# EAGLE design DB3000 (EAGLE 8.4.3)
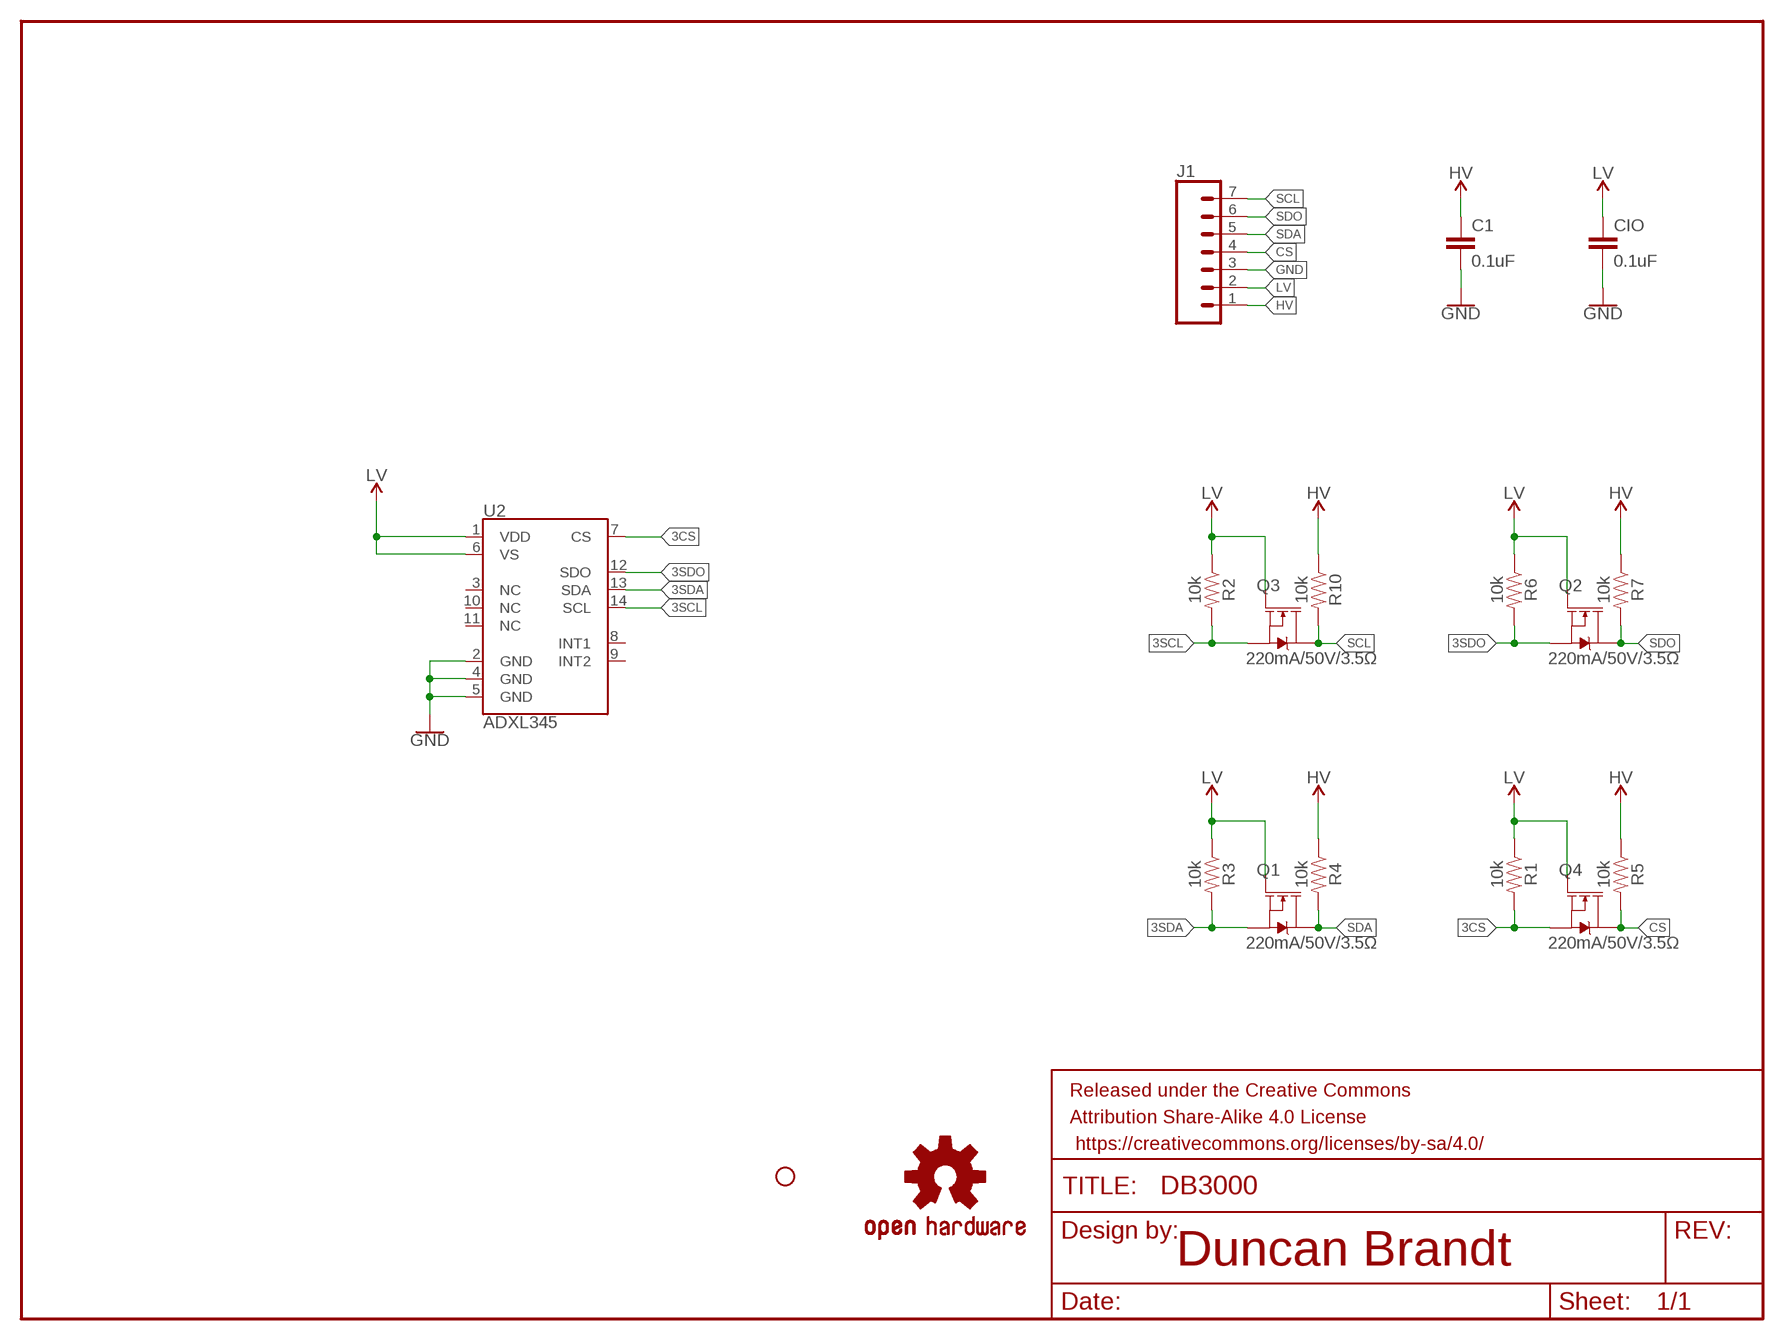
[diagram p0: schematic, sheet 1]

## Parts
C1  0.1uF  0.1UF-0603-25V-5%  [0603]
CIO  0.1uF  0.1UF-0603-25V-5%  [0603]
FRAME1  FRAME-LETTER  [CREATIVE_COMMONS]
J1  CONN_07  [1X07]
JP3  STAND-OFF  [STAND-OFF]
LOGO1  OSHW-LOGOL  [OSHW-LOGO-L]
Q1  220mA/50V/3.5Ω  MOSFET-NCH-M-BSS138  [SOT23-3]
Q2  220mA/50V/3.5Ω  MOSFET-NCH-M-BSS138  [SOT23-3]
Q3  220mA/50V/3.5Ω  MOSFET-NCH-M-BSS138  [SOT23-3]
Q4  220mA/50V/3.5Ω  MOSFET-NCH-M-BSS138  [SOT23-3]
R1  10k  10KOHM-0603-1/10W-1%  [0603]
R2  10k  10KOHM-0603-1/10W-1%  [0603]
R3  10k  10KOHM-0603-1/10W-1%  [0603]
R4  10k  10KOHM-0603-1/10W-1%  [0603]
R5  10k  10KOHM-0603-1/10W-1%  [0603]
R6  10k  10KOHM-0603-1/10W-1%  [0603]
R7  10k  10KOHM-0603-1/10W-1%  [0603]
R10  10k  10KOHM-0603-1/10W-1%  [0603]
U2  ADXL345  [LGA-14]

## Nets
3CS: Q4.2(S) R1.2 U2.7(CS)
3SCL: Q3.2(S) R2.2 U2.14(SCL)
3SDA: Q1.2(S) R3.2 U2.13(SDA)
3SDO: Q2.2(S) R6.2 U2.12(SDO)
CS: J1.4 Q4.3(D) R5.2
GND: C1.2 CIO.2 J1.3 U2.2(GND) U2.4(GND) U2.5(GND)
HV: C1.1 J1.1 R4.1 R5.1 R7.1 R10.1
LV: CIO.1 J1.2 Q1.1(G) Q2.1(G) Q3.1(G) Q4.1(G) R1.1 R2.1 R3.1 R6.1 U2.1(VDD) U2.6(VS)
SCL: J1.7 Q3.3(D) R10.2
SDA: J1.5 Q1.3(D) R4.2
SDO: J1.6 Q2.3(D) R7.2
Unconnected: U2.3(NC) U2.8(INT1) U2.9(INT2) U2.10(NC) U2.11(NC)

## Notes on the sheet
- Duncan Brandt

## Library data of the parts
C1 CIO = DB-CAP:0.1UF: 0.1µF ceramic capacitors Package: 0603 A capacitor is a passive two-terminal electrical component used to store electrical energy temporarily in an electric field. DB BOARDS: DB Drawing Board <www.dbboards.com>; PROD_ID: CAP-08604
FRAME1 = DB-SYMBOLS:FRAME-LETTER: Schematic Frame - Letter Standard 8.5x11 US Letter frame
J1 = DB-CONN:CONN_07: 7 Pin Header Multi connection point. Often used as Generic Header-pin footprint for 0.1 inch spaced/style header connections DB BOARDS: DB Drawing Board <www.dbboards.com>
JP3 = DB-HARDWARE:STAND-OFF: #4 Phillips Hole Screw Hole Mount Hole DB BOARDS: DB Drawing Board <www.dbboards.com>
LOGO1 = DB-SYMBOLS:OSHW-LOGO: Open-Source Hardware (OSHW) Logo This logo indicates the piece of hardware it is found on incorporates a OSHW license and/or adheres to the definition of open source hardware found here: http://freedomdefined.org/OSHW
Q1-Q4 = DB-DESCSEMI:MOSFET-NCH-M: N-channel MOSFETs Voltage controlled devices that allow control of high current outputs.; PROD_ID: DBP2101
R1-R7 R10 = DB-RES:10KOHM: 10kΩ Resistor Package: 0603 A resistor is a passive two-terminal electrical component that implements electrical resistance as a circuit element. Resistors act to reduce current flow, and, at the same time, act to lower voltage levels within circuits. - Wikipedia DB BOARDS: DB Drawing Board <www.dbboards.com>; PROD_ID: RES-00824
U2 = DB-IC:ADXL345: Analog Devices ADXL345 3-Axis SPI/I2C 2/4/8/16g Accelerometer The ADXL345 is a small, thin, low power, 3-axis accelerometer with high resolution (13-bit) measurement at up to ±16g. Digital output data is formatted as 16-bit twos complement and is accessible through either a SPI (3- or 4-wire) or I2C digital interface.; PROD_ID: DBP1002; SF_ID: DB3000

## Board
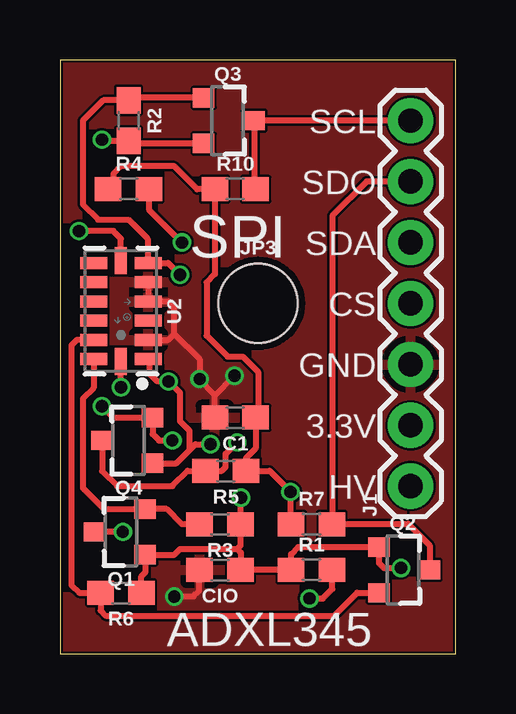
[diagram p1: board, top side]
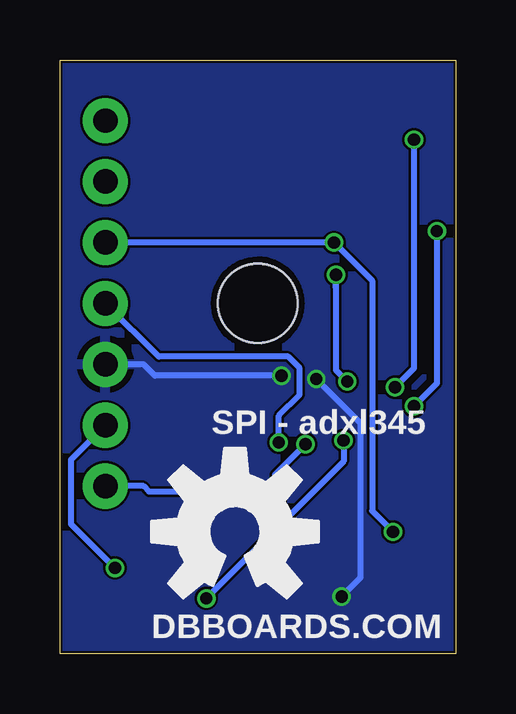
[diagram p2: board, bottom side, seen from below]

Size 16.5 x 24.75 mm. Coordinates in mm from the lower left corner, seen from the top.
Outline: 0,0 16.5,0 16.5,24.75 0,24.75 0,0
Copper layers (1*16): Top 0.035mm / dielectric 1.5mm / Bottom 0.035mm
Design rules "SparkFun-2-layer-FAB-LIMIT": minimum track width 4mil, minimum drill 6mil, track to track 4mil, track to pad 4mil, pad to pad 4mil, via to via 4mil, smd to smd 4mil, copper to edge 4mil, drill to drill 4mil, minimum pad ring 5mil, minimum via ring 5mil, stop-mask expansion 4mil, vias tented up to drill 25mil, thermal gap 10mil

### Footprints (pad centres in the part's own frame; a part is rotated, then mirrored left to right if it is on the bottom)
0603 = smd 1.1 x 1: 1 -0.85,0; 2 0.85,0
1X07 = drill 1.016 pad 1.88: 1 0,0; 2 2.54,0; 3 5.08,0; 4 7.62,0; 5 10.16,0; 6 12.7,0; 7 15.24,0
STAND-OFF = hole 3.302: 0,0
SOT23-3 = smd 0.8 x 0.9: 1 -0.95,-1; 2 0.95,-1; 3 0,1.1
LGA-14 = smd 0.5 x 1.124: 1 2,1.138; 2 1.2,1.138; 3 0.4,1.138; 4 -0.4,1.138; 5 -1.2,1.138; 6 -2,1.138; 8 -2,-1.13; 9 -1.2,-1.138; 10 -0.4,-1.138; 11 0.4,-1.138; 12 1.2,-1.138; 13 2,-1.138 | smd 1.124 x 0.5: 7 -2.1,0; 14 2.1,0

### Placement (x,y rotation side)
C1  7.3,9.84 180 top
CIO  6.67,3.49 180 top
FRAME1  43.81,19.68 0 top  (outside the outline)
J1  14.61,6.99 90 top
JP3  8.26,14.61 0 top
LOGO1  9.21,5.08 0 bottom
Q1  2.54,5.08 90 top
Q2  14.29,3.49 270 top
Q3  6.99,22.23 270 top
Q4  2.86,8.89 90 top
R1  10.48,3.49 0 top
R2  2.86,22.23 270 top
R3  6.67,5.4 180 top
R4  2.86,19.37 0 top
R5  6.91,7.62 180 top
R6  2.54,2.54 180 top
R7  10.48,5.4 0 top
R10  7.3,19.37 0 top
U2  2.54,14.29 270 top

### Tracks (layer width: path | path; a pad name or v marks a point on that pad's centre or on a via)
3CS  (via drill 0.51)
  Top 0.254: U2.7 2.54,17.3 2.22,17.62 v0.79,17.62 | v1.75,10.32 2.23,9.84 Q4.2 3.86,9.16 4.13,8.89 v4.68,8.89 | v10.4,2.3 10.95,2.3 11.35,2.7 11.35,3.47 R1.2
  Bottom 0.254: v0.79,17.62 0.79,11.27 1.59,10.48 v1.75,10.32 | v4.68,8.89 4.68,8.02 v10.4,2.3
3SCL  (via drill 0.51)
  Top 0.254: Q3.2 2.96,21.27 R2.2 1.8,21.38 v1.75,21.43 | v2.54,11.11 U2.14
  Bottom 0.254: v1.75,21.43 1.75,11.91 2.38,11.27 v2.54,11.11
3SDA
  Top 0.254: U2.13 1.4,11.09 0.95,10.64 0.95,6.91 1.83,6.03 Q1.2 4.45,6.03 5.08,5.4 R3.2
3SDO
  Top 0.254: U2.12 0.7,13.09 0.48,12.86 0.48,2.86 0.79,2.54 R6.2 1.69,1.8 1.91,1.59 11.43,1.59 12.38,2.54 Q2.2
CS  (via drill 0.51)
  Top 0.254: Q4.3 1.76,7.61 2.38,6.99 4.68,6.99 5.32,7.62 R5.2 6.75,7.62 6.91,7.78 6.91,8.33 v7.38,8.81
  Bottom 0.254: v7.38,8.81 7.38,9.92 6.51,10.79 6.51,11.91 6.99,12.38 12.38,12.38 J1.4
GND  (via drill 0.51)
  Top 0.254: U2.2 4.51,13.09 4.76,13.34 | 4.76,13.34 4.76,14.45 4.52,14.68 U2.4 U2.5 | 4.76,13.34 5.82,12.28 v5.82,11.45 5.79,11.43 6.45,10.77 | v4.76,2.38 5.56,2.38 5.79,2.62 5.79,3.47 CIO.2 | C1.2 6.45,10.77 | 6.45,10.77 v7.27,11.59 7.3,11.59
  Bottom 0.254: v4.76,2.38 3.97,3.17 3.97,9.6 v5.82,11.45 | J1.3 13.02,12.06 12.54,11.59 7.62,11.59 7.3,11.59 v7.27,11.59
  pour Top (isolate 0.305): 0,24.77 16.51,24.77 16.51,0 0,0
  pour Bottom: 0,24.77 16.51,24.77 16.51,0 0,0
  pour Top: 0,24.77 16.51,24.77 16.51,0 0,0
HV  (via drill 0.51)
  Top 0.254: R4.1 2.22,19.58 2.22,20 2.54,20.32 4.76,20.32 5.71,19.37 R10.1 6.45,15.82 6.11,15.48 6.11,13.26 6.99,12.38 7.62,12.38 8.26,11.75 8.26,9.95 C1.1 8.15,8.55 7.76,8.15 R5.1 8.73,7.62 v9.6,6.75 9.6,5.42 R7.1
  Bottom 0.254: v9.6,6.75 12.78,6.75 13.02,6.99 J1.1
LV  (via drill 0.51)
  Top 0.254: Q3.1 2.96,23.18 R2.1 1.8,23.07 0.95,22.23 0.95,18.73 1.59,18.1 2.86,18.1 3.65,17.3 3.65,16.31 U2.6 4.51,16.29 v5,15.8 | U2.1 3.73,12.23 3.73,11.67 4.05,11.35 v4.52,11.35 5,10.87 5,9.68 5.4,9.29 5.4,8.49 | R6.1 3.39,3.23 3.57,3.41 3.57,4.1 Q1.1 4.76,4.13 5,4.37 7.38,4.37 | 7.38,4.37 7.54,4.21 7.54,3.52 | 7.54,3.52 CIO.1 | 7.38,4.37 7.52,4.5 R3.1 7.52,6.49 v7.54,6.51 | 7.54,3.52 9.6,3.52 R1.1 9.63,4.15 9.92,4.45 Q2.1 13.29,3.78 13.49,3.57 v14.21,3.57 | Q4.1 4.84,7.94 5.4,8.49 | 5.4,8.49 5.64,8.73 v6.27,8.73
  Bottom 0.254: 5,15.24 v5,15.8 5,15.24 | 5,15.24 5,11.83 4.84,11.67 v4.52,11.35 | v6.27,8.73 7.54,7.46 v7.54,6.51 | v14.21,3.57 16.03,5.4 16.03,8.1 J1.2
N$1
  pour Bottom (isolate 0.305): 0,24.77 16.51,24.77 16.51,0 0,0
SCL
  Top 0.254: J1.7 Q3.3 8.09,19.43 R10.2
SDA  (via drill 0.51)
  Top 0.254: R4.2 3.71,18.52 v5.08,17.14 | v2.62,5.08 Q1.3
  Bottom 0.254: J1.5 v5.08,17.14 3.49,15.56 3.49,5.95 v2.62,5.08
SDO
  Top 0.254: J1.6 12.78,19.68 11.35,18.26 11.35,5.42 | 11.35,5.42 R7.2 | 11.35,5.42 14.5,5.42 15.4,4.52 15.4,3.5 Q2.3

### Text on the board
tPlace: SCL | SDO | SDA | SPI | CS | GND | 3.3V | HV | ADXL345
bPlace: SPI - adxl345 | DBBOARDS.COM